# Altium schematic sheet T35_4_FX3.SchDoc
size A3
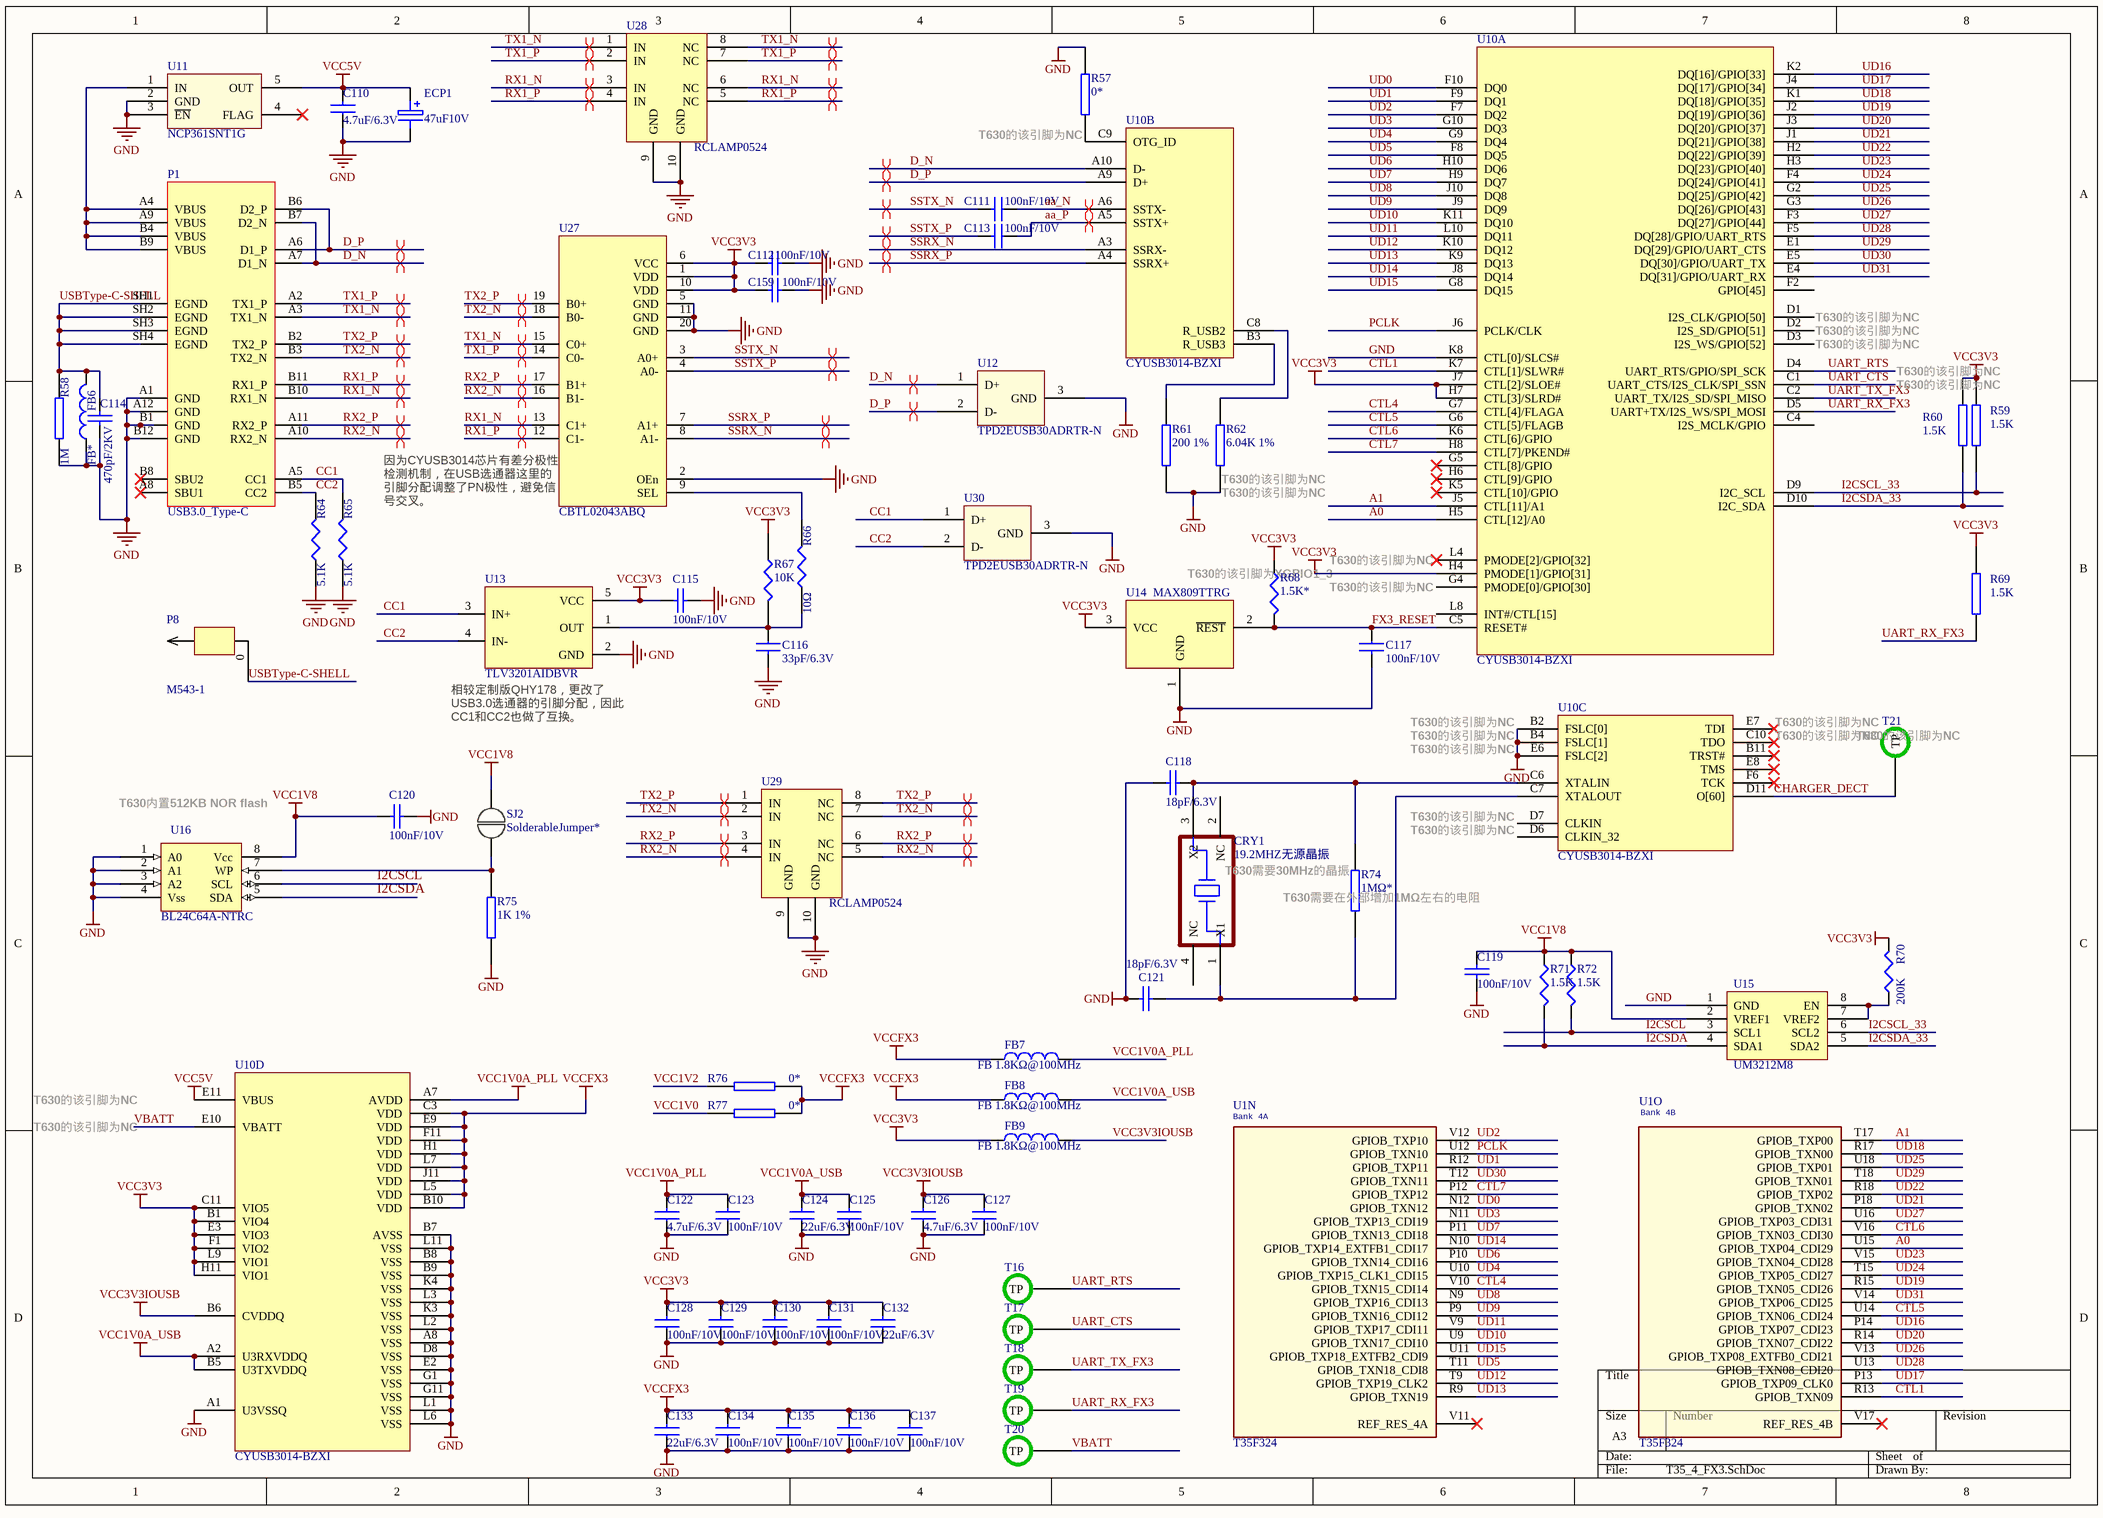
[diagram p0: T35_4_FX3.SchDoc]

## Parts
C110  4.7uF/6.3V  [0402CS]
C111  100nF/10V  [0201CS]
C112  100nF/10V  [0201CS]
C113  100nF/10V  [0201CS]
C114  470pF/2KV  [1206CS]
C115  100nF/10V  [0201CS]
C116  33pF/6.3V  [0402CS]
C117  100nF/10V  [0201CS]
C118  18pF/6.3V  [0201CS]
C119  100nF/10V  [0201CS]
C120  100nF/10V  [0201CS]
C121  18pF/6.3V  [0201CS]
C122  4.7uF/6.3V  [0402CS]
C123  100nF/10V  [0201CS]
C124  22uF/6.3V  [0603CS]
C125  100nF/10V  [0201CS]
C126  4.7uF/6.3V  [0402CS]
C127  100nF/10V  [0201CS]
C128  100nF/10V  [0201CS]
C129  100nF/10V  [0201CS]
C130  100nF/10V  [0201CS]
C131  100nF/10V  [0201CS]
C132  22uF/6.3V  [0603CS]
C133  22uF/6.3V  [0603CS]
C134  100nF/10V  [0201CS]
C135  100nF/10V  [0201CS]
C136  100nF/10V  [0201CS]
C137  100nF/10V  [0201CS]
C159  100nF/10V  [0201CS]
CRY1  19.2MHZ无源晶振  [XTAL_SMD_SMALL]
ECP1  47uF10V  [CASE-B]
FB6  FB*  [FB0603]
FB7  FB 1.8KΩ@100MHz  [FB0603]
FB8  FB 1.8KΩ@100MHz  [FB0603]
FB9  FB 1.8KΩ@100MHz  [FB0603]
P1  USB3.0_Type-C  [CONN_105450-0101_MOL - duplicate]
P8  M543-1  [M543-1]
R57  0*  [0201RS]
R58  1M  [0603RS]
R59  1.5K  [0402RS]
R60  1.5K  [0402RS]
R61  200 1%  [0402RS]
R62  6.04K 1%  [0402RS]
R64  5.1K  [0201RS]
R65  5.1K  [0201RS]
R66  10Ω  [0402RS]
R67  10K  [0201RS]
R68  1.5K*  [0402RS]
R69  1.5K  [0402RS]
R70  200K  [0201RS]
R71  1.5K  [0402RS]
R72  1.5K  [0402RS]
R74  1MΩ*  [0402RS]
R75  1K 1%  [0402RS]
R76  0*  [0402RS]
R77  0*  [0402RS]
SJ2  SolderableJumper*  [SJ]
T16  (no value)  [TP-S]
T17  (no value)  [TP-S]
T18  (no value)  [TP-S]
T19  (no value)  [TP-S]
T20  (no value)  [TP-S]
T21  (no value)  [TP-S]
U1  T35F324  [T35-F324-BGA100P9X9-81A]  (parts N,O of 17)
U10  CYUSB3014-BZXI  [CYUSB3014]  (parts A,B,C,D of 4)
U11  NCP361SNT1G  [SOT-23-5]
U12  TPD2EUSB30ADRTR-N  [DRT0003A]
U13  TLV3201AIDBVR  [sot-23-5]
U14  MAX809TTRG  [MAX809]
U15  UM3212M8  [MSOP8]
U16  BL24C64A-NTRC  [UDFN-8LL]
U27  CBTL02043ABQ  [VQFN-20]
U28  RCLAMP0524  [RCLAMP0524]
U29  RCLAMP0524  [RCLAMP0524]
U30  TPD2EUSB30ADRTR-N  [DRT0003A]

## Nets
GND: C110.1 C112.1 C114.1 C115.1 C116.2 C117.2 C118.1 C119.2 C120.1 C121.2 C122.1 C123.1 C124.1 C125.1 C126.1 C127.1 C128.1 C129.1 C130.1 C131.1 C132.1 C133.1 C134.1 C135.1 C136.1 C137.1 C159.1 ECP1.2 FB6.1 P1.A1(GND) P1.A12(GND) P1.B1(GND) P1.B12(GND) R57.1 R58.2 R61.2 R62.2 R64.1 R65.1 R75.2 U10.A1(U3VSSQ) U10.A8(VSS) U10.B2(FSLC[0]) U10.B4(FSLC[1]) U10.B7(AVSS) U10.B8(VSS) U10.B9(VSS) U10.D8(VSS) U10.E2(VSS) U10.E6(FSLC[2]) U10.G1(VSS) U10.G11(VSS) U10.K3(VSS) U10.K4(VSS) U10.K8(CTL[0]/SLCS#) U10.L1(VSS) U10.L2(VSS) U10.L3(VSS) U10.L6(VSS) U10.L11(VSS) U11.2(GND) U11.3(~{EN}) U12.3(GND) U13.2(GND) U14.1(GND) U15.1(GND) U16.1(A0) U16.2(A1) U16.3(A2) U16.4(Vss) U27.2(OEn) U27.5(GND) U27.11(GND) U27.20(GND) U28.9(GND) U28.10(GND) U29.9(GND) U29.10(GND) U30.3(GND)
VCC1V0A_PLL: C122.2 C123.2 FB7.2 U10.A7(AVDD)
VCC1V0A_USB: C124.2 C125.2 FB8.2 U10.A2(U3RXVDDQ) U10.B5(U3TXVDDQ)
VCC1V8: C119.1 C120.2 R71.1 R72.1 SJ2.1 U15.2(VREF1) U16.8(Vcc)
VCC3V3: C112.2 C115.2 C128.2 C129.2 C130.2 C131.2 C132.2 C159.2 FB9.1 R59.1 R60.1 R67.1 R68.1 R69.1 R70.2 U10.B1(VIO4) U10.C11(VIO5) U10.E3(VIO3) U10.F1(VIO2) U10.H4(PMODE[1]/GPIO[31]) U10.H7(CTL[3]/SLRD#) U10.H11(VIO1) U10.J7(CTL[2]/SLOE#) U10.L9(VIO1) U13.5(VCC) U14.3(VCC) U27.1(VDD) U27.6(VCC) U27.10(VDD)
VCC3V3IOUSB: C126.2 C127.2 FB9.2 U10.B6(CVDDQ)
VCC5V: C110.2 ECP1.1 U10.E11(VBUS) U11.5(OUT)
VCCFX3: C133.2 C134.2 C135.2 C136.2 C137.2 FB7.1 FB8.1 R76.1 R77.1 U10.B10(VDD) U10.C3(VDD) U10.E9(VDD) U10.F11(VDD) U10.H1(VDD) U10.J11(VDD) U10.L5(VDD) U10.L7(VDD)
A0: U1.U15(GPIOB_TXP04_CDI29) U10.H5(CTL[12]/A0)
A1: U1.T17(GPIOB_TXP00) U10.J5(CTL[11]/A1)
aa_N: C111.1 U10.A6(SSTX-)
aa_P: C113.1 U10.A5(SSTX+)
CC1: P1.A5(CC1) R65.2 U13.3(IN+) U30.1(D+)
CC2: P1.B5(CC2) R64.2 U13.4(IN-) U30.2(D-)
CHARGER_DECT: T21.1(TP) U10.D11(O[60])
CTL1: U1.R13(GPIOB_TXN09) U10.K7(CTL[1]/SLWR#)
CTL4: U1.V10(GPIOB_TXN15_CDI14) U10.G7(CTL[4]/FLAGA)
CTL5: U1.U14(GPIOB_TXN06_CDI24) U10.G6(CTL[5]/FLAGB)
CTL6: U1.V16(GPIOB_TXN03_CDI30) U10.K6(CTL[6]/GPIO)
CTL7: U1.P12(GPIOB_TXP12) U10.H8(CTL[7]/PKEND#)
D_N: P1.A7(D1_N) P1.B7(D2_N) U10.A10(D-) U12.1(D+)
D_P: P1.A6(D1_P) P1.B6(D2_P) U10.A9(D+) U12.2(D-)
FX3_RESET: C117.1 R68.2 U10.C5(RESET#) U14.2(~{REST})
I2CSCL: R72.2 U15.3(SCL1) U16.6(SCL)
I2CSCL_33: R59.2 U10.D9(I2C_SCL) U15.6(SCL2)
I2CSDA: R71.2 U15.4(SDA1) U16.5(SDA)
I2CSDA_33: R60.2 U10.D10(I2C_SDA) U15.5(SDA2)
PCLK: U1.U12(GPIOB_TXN10) U10.J6(PCLK/CLK)
RX1_N: P1.B10(RX1_N) U27.13(C1+) U28.3(IN) U28.6(NC)
RX1_P: P1.B11(RX1_P) U27.12(C1-) U28.4(IN) U28.5(NC)
RX2_N: P1.A10(RX2_N) U27.16(B1-) U29.4(IN) U29.5(NC)
RX2_P: P1.A11(RX2_P) U27.17(B1+) U29.3(IN) U29.6(NC)
SSRX_N: U10.A3(SSRX-) U27.8(A1-)
SSRX_P: U10.A4(SSRX+) U27.7(A1+)
SSTX_N: C111.2 U27.3(A0+)
SSTX_P: C113.2 U27.4(A0-)
TX1_N: P1.A3(TX1_N) U27.15(C0+) U28.1(IN) U28.8(NC)
TX1_P: P1.A2(TX1_P) U27.14(C0-) U28.2(IN) U28.7(NC)
TX2_N: P1.B3(TX2_N) U27.18(B0-) U29.2(IN) U29.7(NC)
TX2_P: P1.B2(TX2_P) U27.19(B0+) U29.1(IN) U29.8(NC)
UART_CTS: T17.1(TP) U10.C1(UART_CTS/I2S_CLK/SPI_SSN)
UART_RTS: T16.1(TP) U10.D4(UART_RTS/GPIO/SPI_SCK)
UART_RX_FX3: R69.2 T19.1(TP) U10.D5(UART+TX/I2S_WS/SPI_MOSI)
UART_TX_FX3: T18.1(TP) U10.C2(UART_TX/I2S_SD/SPI_MISO)
UD0: U1.N12(GPIOB_TXN12) U10.F10(DQ0)
UD1: U1.R12(GPIOB_TXP11) U10.F9(DQ1)
UD2: U1.V12(GPIOB_TXP10) U10.F7(DQ2)
UD3: U1.N11(GPIOB_TXP13_CDI19) U10.G10(DQ3)
UD4: U1.U10(GPIOB_TXP15_CLK1_CDI15) U10.G9(DQ4)
UD5: U1.T11(GPIOB_TXN18_CDI8) U10.F8(DQ5)
UD6: U1.P10(GPIOB_TXN14_CDI16) U10.H10(DQ6)
UD7: U1.P11(GPIOB_TXN13_CDI18) U10.H9(DQ7)
UD8: U1.N9(GPIOB_TXP16_CDI13) U10.J10(DQ8)
UD9: U1.P9(GPIOB_TXN16_CDI12) U10.J9(DQ9)
UD10: U1.U9(GPIOB_TXN17_CDI10) U10.K11(DQ10)
UD11: U1.V9(GPIOB_TXP17_CDI11) U10.L10(DQ11)
UD12: U1.T9(GPIOB_TXP19_CLK2) U10.K10(DQ12)
UD13: U1.R9(GPIOB_TXN19) U10.K9(DQ13)
UD14: U1.N10(GPIOB_TXP14_EXTFB1_CDI17) U10.J8(DQ14)
UD15: U1.U11(GPIOB_TXP18_EXTFB2_CDI9) U10.G8(DQ15)
UD16: U1.P14(GPIOB_TXP07_CDI23) U10.K2(DQ[16]/GPIO[33])
UD17: U1.P13(GPIOB_TXP09_CLK0) U10.J4(DQ[17]/GPIO[34])
UD18: U1.R17(GPIOB_TXN00) U10.K1(DQ[18]/GPIO[35])
UD19: U1.R15(GPIOB_TXN05_CDI26) U10.J2(DQ[19]/GPIO[36])
UD20: U1.R14(GPIOB_TXN07_CDI22) U10.J3(DQ[20]/GPIO[37])
UD21: U1.P18(GPIOB_TXN02) U10.J1(DQ[21]/GPIO[38])
UD22: U1.R18(GPIOB_TXP02) U10.H2(DQ[22]/GPIO[39])
UD23: U1.V15(GPIOB_TXN04_CDI28) U10.H3(DQ[23]/GPIO[40])
UD24: U1.T15(GPIOB_TXP05_CDI27) U10.F4(DQ[24]/GPIO[41])
UD25: U1.U18(GPIOB_TXP01) U10.G2(DQ[25]/GPIO[42])
UD26: U1.V13(GPIOB_TXP08_EXTFB0_CDI21) U10.G3(DQ[26]/GPIO[43])
UD27: U1.U16(GPIOB_TXP03_CDI31) U10.F3(DQ[27]/GPIO[44])
UD28: U1.U13(GPIOB_TXN08_CDI20) U10.F5(DQ[28]/GPIO/UART_RTS)
UD29: U1.T18(GPIOB_TXN01) U10.E1(DQ[29]/GPIO/UART_CTS)
UD30: U1.T12(GPIOB_TXN11) U10.E5(DQ[30]/GPIO/UART_TX)
UD31: U1.V14(GPIOB_TXP06_CDI25) U10.E4(DQ[31]/GPIO/UART_RX)
USBType-C-SHELL: C114.2 FB6.2 P1.SH1(EGND) P1.SH2(EGND) P1.SH3(EGND) P1.SH4(EGND) P8.0 R58.1
VBATT: T20.1(TP) U10.E10(VBATT)
VCC1V0: R77.2
VCC1V2: R76.2
NetC116_1: C116.1 R66.1 R67.2 U13.1(OUT)
NetC118_2: C118.2 CRY1.3(X2) R74.1 U10.C6(XTALIN)
NetC121_1: C121.1 CRY1.1(X1) R74.2 U10.C7(XTALOUT)
NetP1_A4: P1.A4(VBUS) P1.A9(VBUS) P1.B4(VBUS) P1.B9(VBUS) U11.1(IN)
NetR57_2: R57.2 U10.C9(OTG_ID)
NetR61_1: R61.1 U10.B3(R_USB3)
NetR62_1: R62.1 U10.C8(R_USB2)
NetR66_2: R66.2 U27.9(SEL)
NetR70_1: R70.1 U15.7(VREF2) U15.8(EN)
NetR75_1: R75.1 SJ2.2 U16.7(WP)

Not connected (* = marked no-connect by the designer): CRY1 2(NC) 4(NC); P1 A8(SBU1)* B8(SBU2)*; U1 V11(REF_RES_4A)* V17(REF_RES_4B)*; U10 B11(TRST#)* C4(I2S_MCLK/GPIO) C10(TDO)* D1(I2S_CLK/GPIO[50]) D2(I2S_SD/GPIO[51]) D3(I2S_WS/GPIO[52]) D6(CLKIN_32) D7(CLKIN) E7(TDI)* E8(TMS)* F2(GPIO[45]) F6(TCK)* G4(PMODE[0]/GPIO[30]) G5(CTL[8]/GPIO)* H6(CTL[9]/GPIO)* K5(CTL[10]/GPIO)* L4(PMODE[2]/GPIO[32])* L8(INT#/CTL[15]); U11 4(FLAG)*

## Layout directives
differential pair: aa_N, aa_P, D_N, D_P, RX1_N, RX1_P, RX2_N, RX2_P, SSRX_N, SSRX_P, SSTX_N, SSTX_P, TX1_N, TX1_P, TX2_N, TX2_P

## Notes on the sheet
- (near R57) T630的该引脚为NC
- T630的该引脚为NC
- (near U27) 因为CYUSB3014芯片有差分极性检测机制，在USB选通器这里的引脚分配调整了PN极性，避免信号交叉。
- (near R62) T630的该引脚为NC
- (near R68) T630的该引脚为XGPIO1_3
- (near U13) 相较定制版QHY178，更改了USB3.0选通器的引脚分配，因此CC1和CC2也做了互换。
- (near T21) T630的该引脚为NC
- (near U16) T630内置512KB NOR flash
- T630需要30MHz的晶振
- (near R74) T630需要在外部增加1MΩ左右的电阻
- (in symbol T35F324, part N) Bank 4A
- (in symbol T35F324, part O) Bank 4B

## Library data of the parts
C110 C117 C122-C137 = CAPACITOR NON-POL: 贴片电容
  C110 C122 C126: Link: https://item.szlcsc.com/3277786.html
  C117 C123 C125 C127-C131 C134-C137: Link: https://item.szlcsc.com/456838.html
  C124 C132 C133: Link: https://item.szlcsc.com/60514.html
C111 C113 C116 = CAPACITOR NON-POL: 贴片电容; Text Field1: 20; Text Field2: 10
  C111 C113: Link: https://item.szlcsc.com/456838.html
C112 C114 C115 C118 C120 C121 C159 = CAP: 贴片电容
  C112 C115 C120 C159: Link: https://item.szlcsc.com/456838.html
  C114: ComponentLink1Description: Link; ComponentLink1URL: https://item.szlcsc.com/3348367.html
C119 = CAP: 贴片电容; Value: 0.1uF ±10% 16V; ComponentLink1Description: Link; ComponentLink1URL: https://item.szlcsc.com/456838.html
CRY1 = CRY-4S: 无源晶振
ECP1 = ELECTRO1: 钽电容
FB6 = INDUCTOR: 贴片磁珠; Value: BLM18SG331TN1
FB7-FB9 = Inductor: 贴片磁珠; Link: https://item.szlcsc.com/373740.html
P1 = USB3.0_Type-C: USB Type-C连接器
P8 = M543-1: 弹簧针
R57-R62 R69 R74-R77 = RES2: 贴片电阻
R64 R65 = RES1: 贴片电阻; Value: 5.1K，±1%
R66 = RES1: 贴片电阻; Value: 10Ω，±1%
R67 = RES1: 贴片电阻; Value: 10K，±1%
R68 R71 R72 = Res3: 贴片电阻; Value: 1.5K ±1%; Published: 8-Jun-2000; LatestRevisionDate: 29-May-2009; LatestRevisionNote: IPC-7351 Footprint Added.; PackageReference: J1-0603; Publisher: Altium Limited; PackageDescription: Chip Resistor
R70 = Res3: 贴片电阻; Value: 200K ±1%; Published: 8-Jun-2000; LatestRevisionDate: 29-May-2009; LatestRevisionNote: IPC-7351 Footprint Added.; PackageReference: J1-0603; Publisher: Altium Limited; PackageDescription: Chip Resistor
SJ2 = SolderableJumper
T16-T21 = TP: 测试点
U1 = T35F324: FPGA芯片; SWAP_INFO: (S1+S2+S3+S4+S5+S6+S7+S8+S9+S10+S11+S12+S13+S14+S15+S16+S17); SPLIT_INST: TRUE
U10 = CYUSB3014: FX3芯片
U11 = NCP361SNT1G: USB过压过流保护芯片
U12 U30 = TPD2EUSB30ADRTR-N: ESD保护器件
U13 = TLV3201AIDBVR: 比较器; Value: TLV3201AIDBVR
U14 = MAX809: 复位芯片
U15 = UM3212M8: I2C电平转换芯片; Value: UM3212MB
U16 = 24LC00: EEPROM芯片; Text Field1: 60; Text Field2: 50
U27 = CBTL02043ABQ: USB3.0选通芯片; Value: HD3SS3212RKSR
U28 U29 = RCLAMP0524: ESD保护器件